# Altium schematic sheet MercurialSDR_FPGA_BNK.SchDoc: p2020 v1
size A4; Author: RF-Lab; DrawnBy: RF-Lab; Revision: Rev1.0; SheetNumber: 5; SheetTotal: 6; ProjectName: MercurialSDR
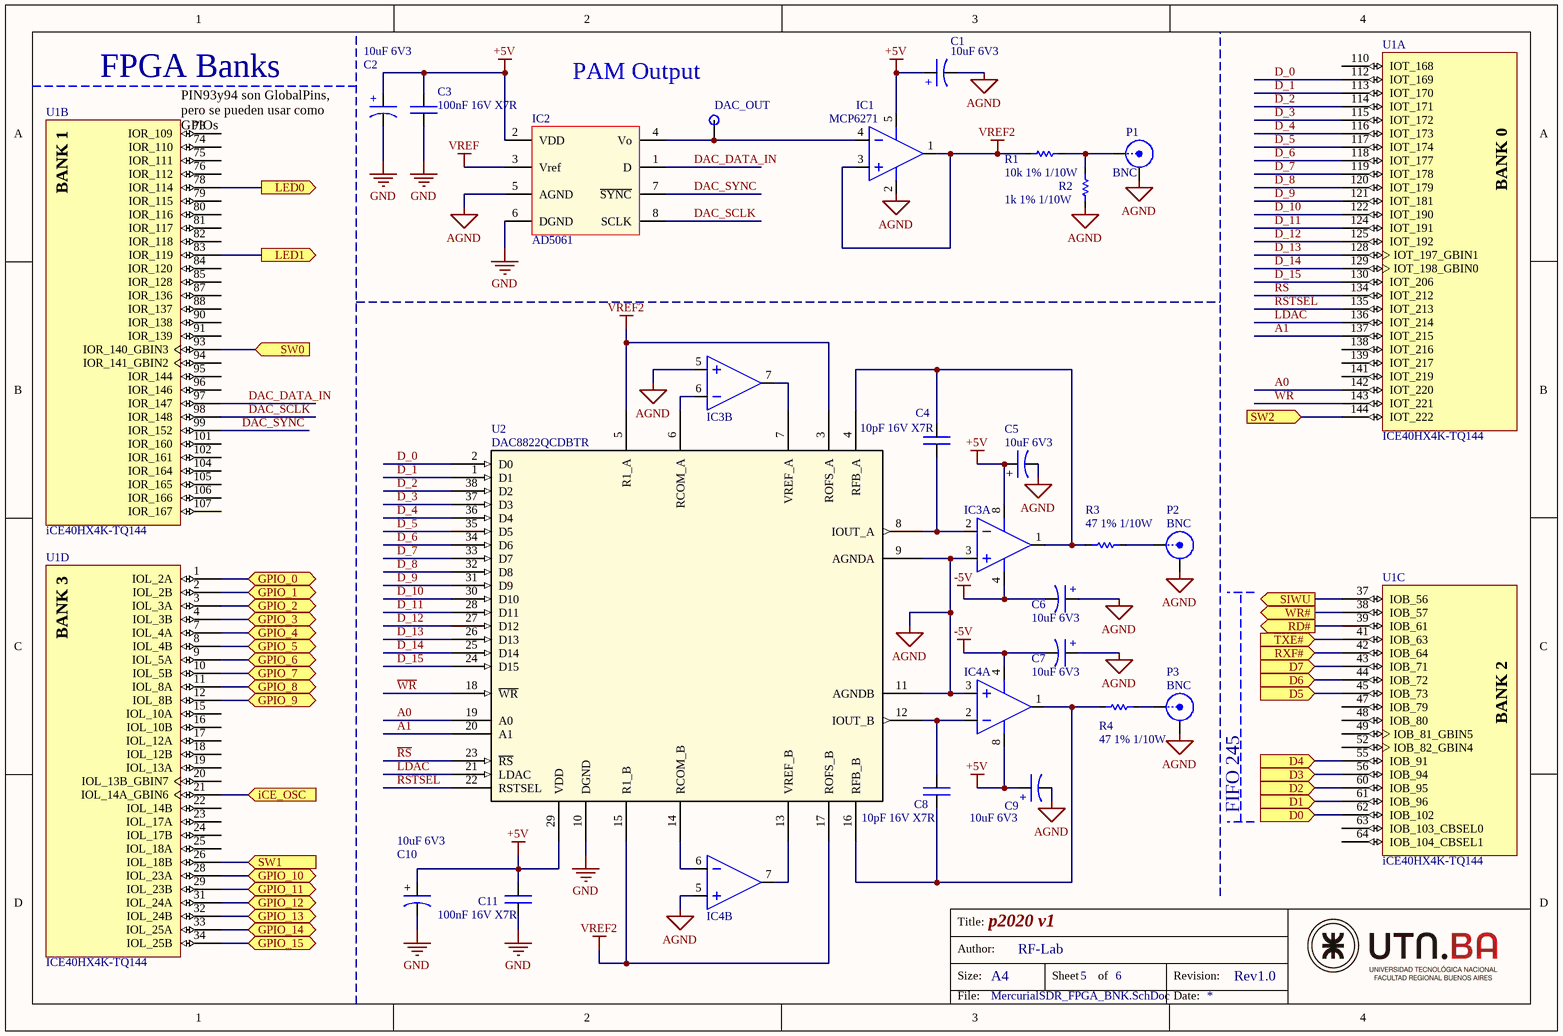
[diagram p0: MercurialSDR_FPGA_BNK.SchDoc]

## Parts
C1  value 10uF 6V3  [CAP_TANT_1206]  (hidden comment: 10uF 6V3 - TAJA106K006RNJ)
C2  value 10uF 6V3  [CAP_TANT_1206]  (hidden comment: 10uF 6V3 - TAJA106K006RNJ)
C3  value 100nF 16V X7R  [CAP_0603]  (hidden comment: 100nF 16V X7R - CL10B104KO8NNNC)
C4  value 10pF 16V X7R  [CAP_0603]  (hidden comment: 10pF 16V X7R - C0603C100K4RAC7867)
C5  value 10uF 6V3  [CAP_TANT_1206]  (hidden comment: 10uF 6V3 - TAJA106K006RNJ)
C6  value 10uF 6V3  [CAP_TANT_1206]  (hidden comment: 10uF 6V3 - TAJA106K006RNJ)
C7  value 10uF 6V3  [CAP_TANT_1206]  (hidden comment: 10uF 6V3 - TAJA106K006RNJ)
C8  value 10pF 16V X7R  [CAP_0603]  (hidden comment: 10pF 16V X7R - C0603C100K4RAC7867)
C9  value 10uF 6V3  [CAP_TANT_1206]  (hidden comment: 10uF 6V3 - TAJA106K006RNJ)
C10  value 10uF 6V3  [CAP_TANT_1206]  (hidden comment: 10uF 6V3 - TAJA106K006RNJ)
C11  value 100nF 16V X7R  [CAP_0603]  (hidden comment: 100nF 16V X7R - CL10B104KO8NNNC)
IC1  Part Number: MCP6271  [SOT-23-5]  (hidden comment: MCP6271 SOT-23-5)
IC2  AD5061  [SOT-23-8]
IC3  OPAMP2277 - OPA2277UA/2K5  [opa2277]  (value not drawn)  (parts A,B of 2)
IC4  OPAMP2277 - OPA2277UA/2K5  [opa2277]  (value not drawn)  (parts A,B of 2)
P1  value BNC  [CONN_73138-5033_]  (hidden comment: 0731385033)
P2  value BNC  [CONN_73138-5033_]  (hidden comment: 0731385033)
P3  value BNC  [CONN_73138-5033_]  (hidden comment: 0731385033)
R1  value 10k 1% 1/10W  [RES_0603]  (hidden comment: 10k 1% 1/10W - CR0603-FX-1002EAS)
R2  value 1k 1% 1/10W  [RES_0603]  (hidden comment: 1k 1% 1/10W - CR0603-FX-1001ELF)
R3  value 47 1% 1/10W  [RES_0603]  (hidden comment: 47 1% 1/10W - CR0603-FX-47R0ELF)
R4  value 47 1% 1/10W  [RES_0603]  (hidden comment: 47 1% 1/10W - CR0603-FX-47R0ELF)
TP1  TP Name: DAC_OUT  [TP_TH]  (hidden comment: Test Point)
U1  ICE40HX4K-TQ144  [LATC-TQFP-144_L]  (parts A,B,C,D of 6)
U2  DAC8822QCDBTR  [dac8822]

## Ports
D0 (in), D1 (in), D2 (in), D3 (in), D4 (in), D5 (in), D6 (in), D7 (in), GPIO_0 (bidir), GPIO_1 (bidir), GPIO_2 (bidir), GPIO_3 (bidir), GPIO_4 (bidir), GPIO_5 (bidir), GPIO_6 (bidir), GPIO_7 (bidir), GPIO_8 (bidir), GPIO_9 (bidir), GPIO_10 (bidir), GPIO_11 (bidir), GPIO_12 (bidir), GPIO_13 (bidir), GPIO_14 (bidir), GPIO_15 (bidir), iCE_OSC (in), LED0 (out), LED1 (out), RD# (out), RXF# (in), SIWU (out), SW0 (in), SW1 (in), SW2 (in), TXE# (in), WR# (out)

## Nets
+5V: C1.1 C2.1 C3.1 C5.1 C9.1 C10.1 C11.1 IC1.5(Vs+) IC2.2(VDD) IC3.8(Vs+) IC4.8(Vs+) U2.29(VDD)
-5V: C6.2 C7.2 IC3.4(Vs-) IC4.4(Vs-)
AGND: C1.2 C5.2 C6.1 C7.1 C9.2 IC1.2(Vs-) IC2.5(AGND) IC3.3(V+) IC3.5(V+) IC4.3(V+) IC4.5(V+) P1.2(Y) P2.2(Y) P3.2(Y) R2.2 U2.9(AGNDA) U2.11(AGNDB)
GND: C2.2 C3.2 C10.2 C11.2 IC2.6(DGND) U2.10(DGND)
VREF: IC2.3(Vref)
VREF2: IC1.1(Vo) IC1.3(V+) R1.1 U2.3(ROFS_A) U2.5(R1_A) U2.15(R1_B) U2.17(ROFS_B)
A0: U1.142(IOT_220) U2.19(A0)
A1: U1.137(IOT_215) U2.20(A1)
D0: U1.62(IOB_102) ; port D0
D1: U1.61(IOB_96) ; port D1
D2: U1.60(IOB_95) ; port D2
D3: U1.56(IOB_94) ; port D3
D4: U1.55(IOB_91) ; port D4
D5: U1.45(IOB_73) ; port D5
D6: U1.44(IOB_72) ; port D6
D7: U1.43(IOB_71) ; port D7
D_0: U1.112(IOT_169) U2.2(D0)
D_1: U1.113(IOT_170) U2.1(D1)
D_2: U1.114(IOT_171) U2.38(D2)
D_3: U1.115(IOT_172) U2.37(D3)
D_4: U1.116(IOT_173) U2.36(D4)
D_5: U1.117(IOT_174) U2.35(D5)
D_6: U1.118(IOT_177) U2.34(D6)
D_7: U1.119(IOT_178) U2.33(D7)
D_8: U1.120(IOT_179) U2.32(D8)
D_9: U1.121(IOT_181) U2.31(D9)
D_10: U1.122(IOT_190) U2.30(D10)
D_11: U1.124(IOT_191) U2.28(D11)
D_12: U1.125(IOT_192) U2.27(D12)
D_13: U1.128(IOT_197_GBIN1) U2.26(D13)
D_14: U1.129(IOT_198_GBIN0) U2.25(D14)
D_15: U1.130(IOT_206) U2.24(D15)
DAC_DATA_IN: IC2.1(D) U1.97(IOR_147)
DAC_SCLK: IC2.8(SCLK) U1.98(IOR_148)
DAC_SYNC: IC2.7(~{SYNC}) U1.99(IOR_152)
GPIO_0: U1.1(IOL_2A) ; port GPIO_0
GPIO_1: U1.2(IOL_2B) ; port GPIO_1
GPIO_2: U1.3(IOL_3A) ; port GPIO_2
GPIO_3: U1.4(IOL_3B) ; port GPIO_3
GPIO_4: U1.7(IOL_4A) ; port GPIO_4
GPIO_5: U1.8(IOL_4B) ; port GPIO_5
GPIO_6: U1.9(IOL_5A) ; port GPIO_6
GPIO_7: U1.10(IOL_5B) ; port GPIO_7
GPIO_8: U1.11(IOL_8A) ; port GPIO_8
GPIO_9: U1.12(IOL_8B) ; port GPIO_9
GPIO_10: U1.28(IOL_23A) ; port GPIO_10
GPIO_11: U1.29(IOL_23B) ; port GPIO_11
GPIO_12: U1.31(IOL_24A) ; port GPIO_12
GPIO_13: U1.32(IOL_24B) ; port GPIO_13
GPIO_14: U1.33(IOL_25A) ; port GPIO_14
GPIO_15: U1.34(IOL_25B) ; port GPIO_15
iCE_OSC: U1.21(IOL_14A_GBIN6) ; port iCE_OSC
LDAC: U1.136(IOT_214) U2.21(LDAC)
LED0: U1.78(IOR_114) ; port LED0
LED1: U1.83(IOR_119) ; port LED1
~{RS}: U1.134(IOT_212) U2.23(~{RS})
RD#: U1.39(IOB_61) ; port RD#
RSTSEL: U1.135(IOT_213) U2.22(RSTSEL)
RXF#: U1.42(IOB_64) ; port RXF#
SIWU: U1.37(IOB_56) ; port SIWU
SW0: U1.93(IOR_140_GBIN3) ; port SW0
SW1: U1.26(IOL_18B) ; port SW1
SW2: U1.144(IOT_222) ; port SW2
TXE#: U1.41(IOB_63) ; port TXE#
~{WR}: U1.143(IOT_221) U2.18(~{WR})
WR#: U1.38(IOB_57) ; port WR#
NetC4_1: C4.1 IC3.1(Vo) R3.1 U2.4(RFB_A)
NetC4_2: C4.2 IC3.2(V-) U2.8(IOUT_A)
NetC8_1: C8.1 IC4.2(V-) U2.12(IOUT_B)
NetC8_2: C8.2 IC4.1(Vo) R4.1 U2.16(RFB_B)
NetIC1_4: IC1.4(V-) IC2.4(Vo) TP1.1(TP?)
NetIC3_6: IC3.6(V-) U2.6(RCOM_A)
NetIC3_7: IC3.7(Vo) U2.7(VREF_A)
NetIC4_6: IC4.6(V-) U2.14(RCOM_B)
NetIC4_7: IC4.7(Vo) U2.13(VREF_B)
NetP1_1: P1.1(X) R1.2 R2.1
NetP2_1: P2.1(X) R3.2
NetP3_1: P3.1(X) R4.2

Not connected (* = marked no-connect by the designer): U1 15(IOL_10A) 16(IOL_10B) 17(IOL_12A) 18(IOL_12B) 19(IOL_13A) 20(IOL_13B_GBIN7) 22(IOL_14B) 23(IOL_17A) 24(IOL_17B) 25(IOL_18A) 47(IOB_79) 48(IOB_80) 49(IOB_81_GBIN5) 52(IOB_82_GBIN4) 63(IOB_103_CBSEL0) 64(IOB_104_CBSEL1) 73(IOR_109) 74(IOR_110) 75(IOR_111) 76(IOR_112) 79(IOR_115) 80(IOR_116) 81(IOR_117) 82(IOR_118) 84(IOR_120) 85(IOR_128) 87(IOR_136) 88(IOR_137) 90(IOR_138) 91(IOR_139) 94(IOR_141_GBIN2) 95(IOR_144) 96(IOR_146) 101(IOR_160) 102(IOR_161) 104(IOR_164) 105(IOR_165) 106(IOR_166) 107(IOR_167) 110(IOT_168) 138(IOT_216) 139(IOT_217) 141(IOT_219)

## Notes on the sheet
- (near U1) FPGA Banks
- PAM Output
- (near U1) PIN93y94 son GlobalPins, pero se pueden usar como GPIOs
- (near P3) FIFO 245
- Title:
- Size:
- Author:
- A4
- Sheet
- of
- Revision:
- File:
- Date:
- (in symbol Cap Pol) +
- (in symbol ICE40HX4K-TQ144, part A) BANK 0
- (in symbol ICE40HX4K-TQ144, part B) BANK 1
- (in symbol ICE40HX4K-TQ144, part C) BANK 2
- (in symbol ICE40HX4K-TQ144, part D) BANK 3

## Library data of the parts
C1 C2 C5-C7 C9 C10 = Cap Pol: Capacitor polarizado
C3 C4 C8 C11 = Cap: Capacitor no polarizado
  C4 C8: Temp Coef: *; Part Number: *; VR: *; Material: *
IC1 = MCP6271T-E/OT: Operational Amplifier
IC2 = AD5061: DAC SPI; Bits: *; Part Number: *
IC3 IC4 = OPAMP2277: Operational Amplifier; Part Number: *
P1-P3 = BNC: BNC Elbow Connector; LatestRevisionDate: 17-Jul-2002; LatestRevisionNote: Re-released for DXP Platform.; Publisher: Altium Limited
R1-R4 = Res: Resistor
U1 = ICE40HX4K-TQ144: iCE40 HX4K Series FPGA Family, 3520 Logic Cells, 1.2 V Core, 80 K Embedded RAM Bits, 144-pin TQFP, Pb-Free, Tray; Manufacturer: Lattice Semiconductor; Phase-Locked Loops: 2; Supply Voltage: 1.2V; Logic Cells: 3520; Embedded RAM Bits: 80K; ComponentLink1Description: Manufacturer URL; ComponentLink2Description: Datasheet; DatasheetVersion: Rev. 02.9; Mounting Technology: Surface Mount; ComponentLink3URL: http://www.latticesemi.com/lit/docs/package/pkg.pdf; ComponentLink3Description: Package Specification; ComponentLink1URL: http://www.latticesemi.com/en; ComponentLink2URL: http://www.latticesemi.com/~/media/Documents/DataSheets/iCE/iCE40LPHXFamilyDataSheet.pdf; PackageReference: TQFP-144; Packing: Tray; PartNumber: ICE40HX4K-TQ144; PackageDescription: 144-Pin Thin Quad Flat Package, Body 20 x 20 mm, Pitch 0.5 mm; PackageVersion: Rev. 03.9, 02/2013; RoHS: TRUE
U2 = DAC8822QCDBTR: 16-Bit, Dual, Parallel Input, Multiplying DAC; Vendor: Texas Instruments; Built_By: EMA_UL_Team; Manufacturer_Part_Number: DAC8822QCDBTR; Copyright: Copyright (C) 2018 Accelerated Designs. All rights reserved; RefDes: RefDes; Type: DEV; Value: Value